# Altium schematic sheet pulse_mux.SchDoc: Analog Pulse Multiplexer
size A; Engineer: A. Peck; Organization: UCLA High Energy Physics; DocumentNumber: 10; Revision: 3.0; SheetNumber: 10; SheetTotal: 15; Project: LCT Comparator Tester
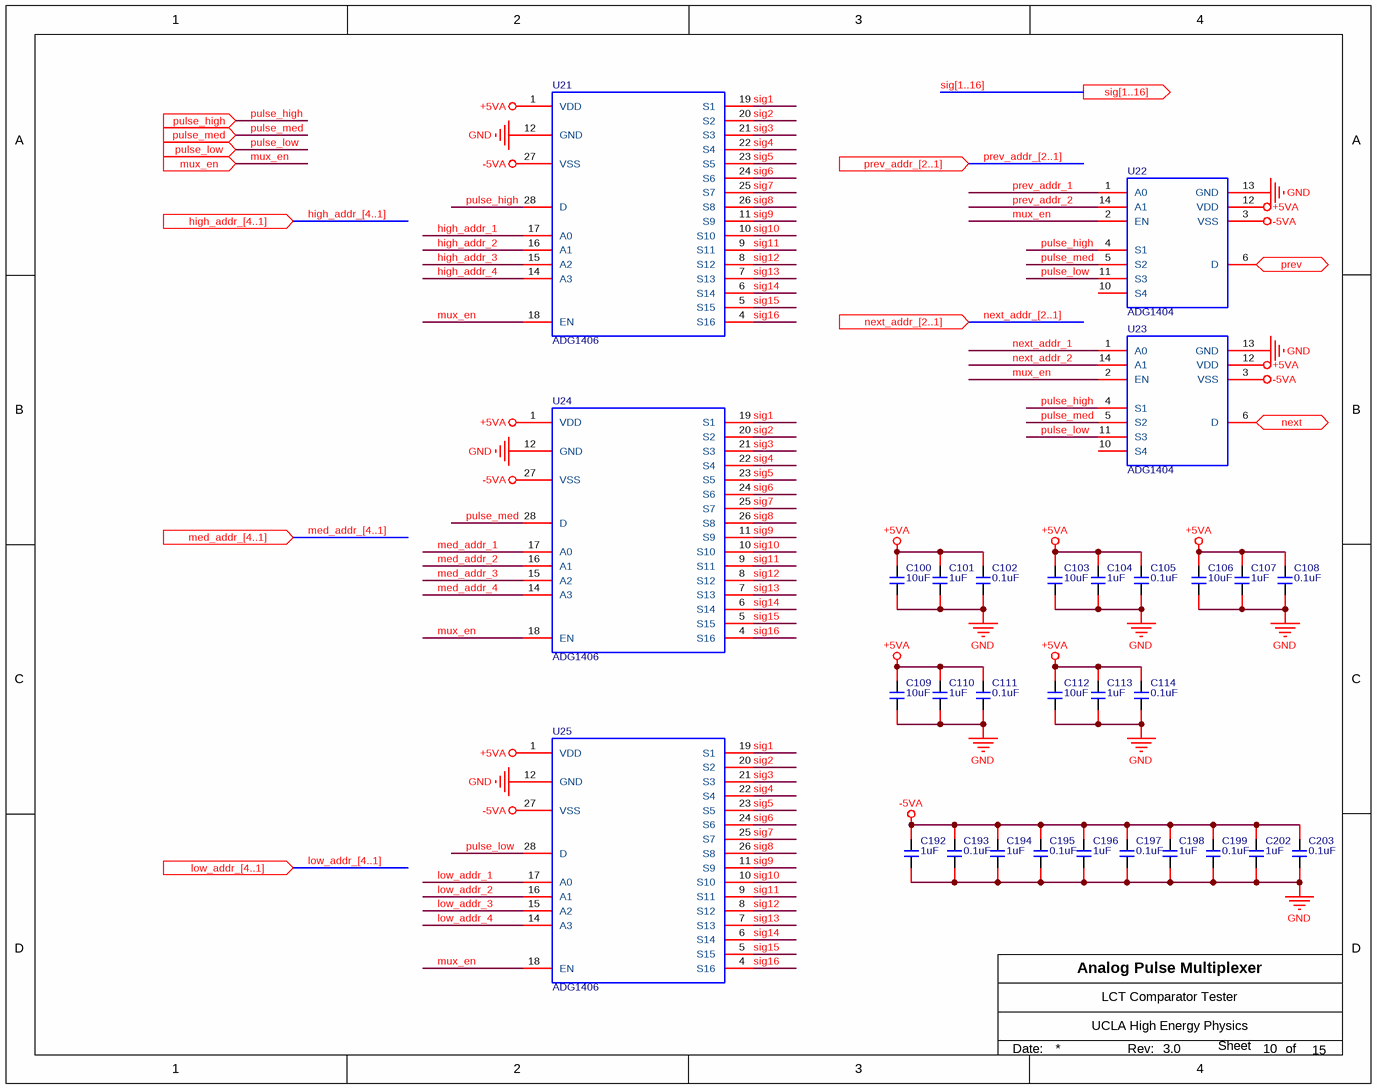
[diagram p0: pulse_mux.SchDoc]

## Parts
C100  10uF  [c1206]
C101  1uF  [C0603]
C102  0.1uF  [C0603]
C103  10uF  [c1206]
C104  1uF  [C0603]
C105  0.1uF  [C0603]
C106  10uF  [c1206]
C107  1uF  [C0603]
C108  0.1uF  [C0603]
C109  10uF  [c1206]
C110  1uF  [C0603]
C111  0.1uF  [C0603]
C112  10uF  [c1206]
C113  1uF  [C0603]
C114  0.1uF  [C0603]
C192  1uF  [C0603]
C193  0.1uF  [C0603]
C194  1uF  [C0603]
C195  0.1uF  [C0603]
C196  1uF  [C0603]
C197  0.1uF  [C0603]
C198  1uF  [C0603]
C199  0.1uF  [C0603]
C202  1uF  [C0603]
C203  0.1uF  [C0603]
U21  ADG1406  [SSOP-28]
U22  ADG1404  [TSSOP-14]
U23  ADG1404  [TSSOP-14]
U24  ADG1406  [SSOP-28]
U25  ADG1406  [SSOP-28]

## Ports
high_addr_[4..1] (in), low_addr_[4..1] (in), med_addr_[4..1] (in), mux_en (in), next (out), next_addr_[2..1] (in), prev (out), prev_addr_[2..1] (in), pulse_high (in), pulse_low (in), pulse_med (in), sig[1..16] (out)

## Nets
+5VA: C100.1 C101.2 C102.2 C103.1 C104.2 C105.2 C106.1 C107.2 C108.2 C109.1 C110.2 C111.2 C112.1 C113.2 C114.2 U21.1(VDD) U22.12(VDD) U23.12(VDD) U24.1(VDD) U25.1(VDD)
-5VA: C192.2 C193.2 C194.2 C195.2 C196.2 C197.2 C198.2 C199.2 C202.2 C203.2 U21.27(VSS) U22.3(VSS) U23.3(VSS) U24.27(VSS) U25.27(VSS)
GND: C100.2 C101.1 C102.1 C103.2 C104.1 C105.1 C106.2 C107.1 C108.1 C109.2 C110.1 C111.1 C112.2 C113.1 C114.1 C192.1 C193.1 C194.1 C195.1 C196.1 C197.1 C198.1 C199.1 C202.1 C203.1 U21.12(GND) U22.13(GND) U23.13(GND) U24.12(GND) U25.12(GND)
high_addr_1: U21.17(A0)
high_addr_2: U21.16(A1)
high_addr_3: U21.15(A2)
high_addr_4: U21.14(A3)
low_addr_1: U25.17(A0)
low_addr_2: U25.16(A1)
low_addr_3: U25.15(A2)
low_addr_4: U25.14(A3)
med_addr_1: U24.17(A0)
med_addr_2: U24.16(A1)
med_addr_3: U24.15(A2)
med_addr_4: U24.14(A3)
mux_en: U21.18(EN) U22.2(EN) U23.2(EN) U24.18(EN) U25.18(EN) ; port mux_en
next: U23.6(D) ; port next
next_addr_1: U23.1(A0)
next_addr_2: U23.14(A1)
prev: U22.6(D) ; port prev
prev_addr_1: U22.1(A0)
prev_addr_2: U22.14(A1)
pulse_high: U21.28(D) U22.4(S1) U23.4(S1) ; port pulse_high
pulse_low: U22.11(S3) U23.11(S3) U25.28(D) ; port pulse_low
pulse_med: U22.5(S2) U23.5(S2) U24.28(D) ; port pulse_med
sig1: U21.19(S1) U24.19(S1) U25.19(S1)
sig2: U21.20(S2) U24.20(S2) U25.20(S2)
sig3: U21.21(S3) U24.21(S3) U25.21(S3)
sig4: U21.22(S4) U24.22(S4) U25.22(S4)
sig5: U21.23(S5) U24.23(S5) U25.23(S5)
sig6: U21.24(S6) U24.24(S6) U25.24(S6)
sig7: U21.25(S7) U24.25(S7) U25.25(S7)
sig8: U21.26(S8) U24.26(S8) U25.26(S8)
sig9: U21.11(S9) U24.11(S9) U25.11(S9)
sig10: U21.10(S10) U24.10(S10) U25.10(S10)
sig11: U21.9(S11) U24.9(S11) U25.9(S11)
sig12: U21.8(S12) U24.8(S12) U25.8(S12)
sig13: U21.7(S13) U24.7(S13) U25.7(S13)
sig14: U21.6(S14) U24.6(S14) U25.6(S14)
sig15: U21.5(S15) U24.5(S15) U25.5(S15)
sig16: U21.4(S16) U24.4(S16) U25.4(S16)

Not connected (* = marked no-connect by the designer): U21 2(NC) 3(NC) 13(NC); U22 7(NC) 8(NC) 9(NC) 10(S4); U23 7(NC) 8(NC) 9(NC) 10(S4); U24 2(NC) 3(NC) 13(NC); U25 2(NC) 3(NC) 13(NC)

## Buses and harness runs
bus high_addr_[4..1] = port high_addr_[4..1]
bus low_addr_[4..1] = port low_addr_[4..1]
bus med_addr_[4..1] = port med_addr_[4..1]
bus next_addr_[2..1] = port next_addr_[2..1]
bus prev_addr_[2..1] = port prev_addr_[2..1]
bus sig[1..16] = port sig[1..16]

## Notes on the sheet
- Date:
- Rev:
- of
- Sheet

## Library data of the parts
C100 C103 C106 C109 C112 = CAP/GMK316F106ZL-T: CAP-CER, 2, 10uF, 10%, 35V, 1206; Manufacturer: Taiyo Yuden; Capacitance: 10µF; Tolerance: -20%, +80%; Temperature Coefficient: Y5V (F); Supplier 1: Digi-Key; Manufacturer Part Number: GMK316F106ZL-T; RoHS: RoHS Compliant; Category: Capacitors; Packaging: Cut Tape (CT); Voltage - Rated: 35V; Operating Temperature: -30°C ~ 85°C; Mounting Type: Surface Mount, MLCC; Package / Case: 1206 (3216 Metric); Size / Dimension: 0.126" L x 0.063" W (3.20mm x 1.60mm); Height - Seated (Max): -; Lead Spacing: -; Features: -; ComponentLink1URL: http://ds.yuden.co.jp/TYCOMPAS/ut/detail.do?productNo=GMK316F106ZL-T&fileName=GMK316F106ZL-T_SS&mode=specSheetDownload; ComponentLink1Description: http://ds.yuden.co.jp/TYCOMPAS/ut/detail.do?productNo=GMK316F106ZL-T&fileName=GMK316F106ZL-T_SS&mode=specSheetDownload; Supplier Part Number 1: 587-1352-1-ND; Stock 1: 249989; Pricing 1: 1=0.46, 10=0.345, 50=0.2012, 100=0.161, 250=0.115, 500=0.0782, 1000=0.06325 (USD); Applications: General Purpose; Ratings: -; Thickness (Max): 0.071" (1.80mm); Lead Style: -
C101 C104 C107 C110 C113 C192 C194 C196 C198 C202 = Murata/GRM188R61E105KA12D: CAP-CER, 2, 1.0uF, 10%, 25V, 0603; Manufacturer: Murata Electronics North America; Capacitance: 1µF; Temperature Coefficient: X5R; Supplier 1: Digi-Key; Supplier Part Number 1: 490-3897-1-ND; Manufacturer Part Number: GRM188R61E105KA12D; RoHS: RoHS Compliant; Category: Capacitors; Stock 1: 1899119; Pricing 1: 1=0.1, 10=0.036, 50=0.0196, 100=0.0165, 250=0.01352, 500=0.01156, 1000=0.009 (USD); Packaging: Cut Tape (CT); Tolerance: ±10%; Voltage - Rated: 25V; Mounting Type: Surface Mount, MLCC; Operating Temperature: -55°C ~ 85°C; Applications: General Purpose; Ratings: -; Package / Case: 0603 (1608 Metric); Size / Dimension: 0.063" L x 0.031" W (1.60mm x 0.80mm); Height - Seated (Max): -; Thickness (Max): 0.035" (0.90mm); Lead Spacing: -; Features: -; Lead Style: -; ComponentLink1URL: http://www.murata.com/~/media/webrenewal/support/library/catalog/products/capacitor/mlcc/c02e.pdf; ComponentLink1Description: http://www.murata.com/~/media/webrenewal/support/library/catalog/products/capacitor/mlcc/c02e.pdf
C102 C105 C108 C111 C114 C193 C195 C197 C199 C203 = CAP/06035C104KAT2A: CAP-CER, 2, 0.1uF, 10%, 50V, 0603, X7R; Manufacturer: AVX Corporation; Capacitance: 0.10µF; Supplier 1: Digi-Key; Manufacturer Part Number: 06035C104KAT2A; RoHS: RoHS Compliant; Category: Capacitors; Stock 1: 4412408; Pricing 1: 1=0.1, 10=0.036, 25=0.0264, 50=0.0198, 100=0.0162, 250=0.01352, 500=0.01156, 1000=0.00908 (USD); Packaging: Cut Tape (CT); Tolerance: ±10%; Voltage - Rated: 50V; Temperature Coefficient: X7R; Mounting Type: Surface Mount, MLCC; Operating Temperature: -55°C ~ 125°C; Applications: General Purpose; Ratings: -; Package / Case: 0603 (1608 Metric); Size / Dimension: 0.063" L x 0.032" W (1.60mm x 0.81mm); Height - Seated (Max): -; Thickness (Max): 0.035" (0.90mm); Lead Spacing: -; Features: -; Lead Style: -; ComponentLink1URL: http://datasheets.avx.com/X7RDielectric.pdf; ComponentLink1Description: http://datasheets.avx.com/X7RDielectric.pdf; Supplier Part Number 1: 478-5052-1-ND; Supplier 2: Newark; Supplier Part Number 2: 54K2412
U21 U24 U25 = ADG1406/SSOP-28: MUX, 16:1, Single Supply; Manufacturer: Analog Devices Inc.; Manufacturer Part Number: ADG1406BRUZ; Number of Circuits: 1; On-State Resistance (Max): 11.5 Ohm; Channel-to-Channel Matching (&Delta;Ron): 550 mOhm; Voltage - Supply, Single (V+): 5 V ~ 16.5 V; Voltage - Supply, Dual (V±): ±4.5 V ~ 16.5 V; Switch Time (Ton, Toff) (Max): 110ns, 120ns; -3db Bandwidth: 60MHz; Charge Injection: 10pC; Channel Capacitance (CS(off), CD(off)): 8pF, 90pf; Current - Leakage (IS(off)) (Max): 250pA; Crosstalk: -70dB @ 1MHz; Supplier 1: Digi-Key; RoHS: RoHS Compliant; Category: Integrated Circuits (ICs); Stock 1: 698; Pricing 1: 1=10.46, 50=9.2172, 100=8.1211, 500=7.22426, 1000=6.62639, 2500=6.37728, 5000=6.17799 (USD); Packaging: Tube; Part Status: Active; Switch Circuit: -; Multiplexer/Demultiplexer Circuit: 16:1; Operating Temperature: -40°C ~ 125°C (TA); Package / Case: 28-TSSOP (0.173", 4.40mm Width); Supplier Device Package: 28-TSSOP; ComponentLink1URL: http://www.analog.com/media/en/technical-documentation/data-sheets/ADG1406_1407.pdf; ComponentLink1Description: http://www.analog.com/media/en/technical-documentation/data-sheets/ADG1406_1407.pdf; Supplier Part Number 1: ADG1406BRUZ-ND
U22 U23 = ADG1404 14-TSSOP: MUX, 4:1, Single; Manufacturer: Analog Devices Inc.; Manufacturer Part Number: ADG1404YRUZ; Switch Circuit: SP4T; Number of Circuits: 1; On-State Resistance (Max): 1.8 Ohm; Channel-to-Channel Matching (&Delta;Ron): 100 mOhm; Voltage - Supply, Single (V+): 5 V ~ 16.5 V; Voltage - Supply, Dual (V±): ±4.5 V ~ 16.5 V; Switch Time (Ton, Toff) (Max): 120ns, 135ns; -3db Bandwidth: 55MHz; Charge Injection: -20pC; Channel Capacitance (CS(off), CD(off)): 23pF, 90pF; Current - Leakage (IS(off)) (Max): 550pA; Crosstalk: -82dB @ 100kHz; Supplier 1: Digi-Key; RoHS: RoHS Compliant; Category: Integrated Circuits (ICs); Stock 1: 6039; Pricing 1: 1=6.98, 96=6.01625, 192=5.22385, 576=4.54885, 1056=3.96191, 2592=3.81517, 5000=3.66844 (USD); Packaging: Tube; Part Status: Active; Multiplexer/Demultiplexer Circuit: 4:1; Operating Temperature: -40°C ~ 125°C (TA); Package / Case: 14-TSSOP (0.173", 4.40mm Width); Supplier Device Package: 14-TSSOP; ComponentLink1URL: http://www.analog.com/media/en/technical-documentation/data-sheets/ADG1404.pdf; ComponentLink1Description: http://www.analog.com/media/en/technical-documentation/data-sheets/ADG1404.pdf; Supplier Part Number 1: ADG1404YRUZ-ND